# Altium schematic sheet Signal from Voltage detection.SchDoc
size A4
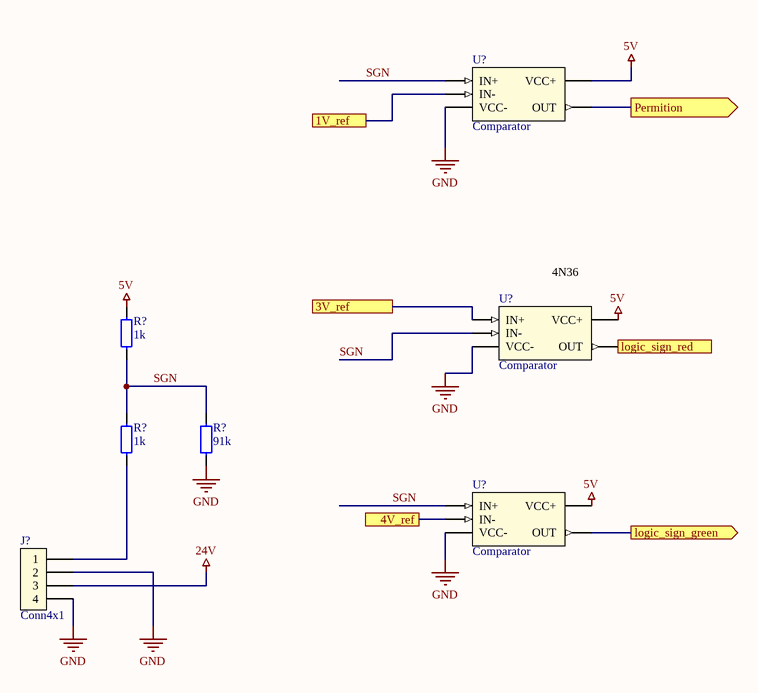
[diagram p0: Signal from Voltage detection.SchDoc]

## Parts
(Parts that share a designator on the sheet are numbered #1, #2 ... from top to bottom, then left to right.)
J?  Conn4x1  [MolexMicroFit 4x1]
R?#1  1k  [0603 Resistor]
R?#2  1k  [0603 Resistor]
R?#3  91k  [0603 Resistor]
U?#1  Comparator  [SOT-23-5]
U?#2  Comparator  [SOT-23-5]
U?#3  Comparator  [SOT-23-5]

## Ports
1V_ref, 3V_ref, 4V_ref, logic_sign_green (out), logic_sign_red (out), Permition (out)

## Nets
5V: R?#1.2 U?#1.5(VCC+) U?#2.5(VCC+) U?#3.5(VCC+)
24V: J?.3
GND: J?.2 J?.4 R?#3.1 U?#1.2(VCC-) U?#2.2(VCC-) U?#3.2(VCC-)
1V_ref: U?#1.4(IN-) ; port 1V_ref
3V_ref: U?#2.3(IN+) ; port 3V_ref
4V_ref: U?#3.4(IN-) ; port 4V_ref
logic_sign_green: U?#3.1(OUT) ; port logic_sign_green
logic_sign_red: U?#2.1(OUT) ; port logic_sign_red
Permition: U?#1.1(OUT) ; port Permition
SGN: R?#1.1 R?#2.2 R?#3.2 U?#1.3(IN+) U?#2.4(IN-) U?#3.3(IN+)
NetJ?_1: J?.1 R?#2.1

## Notes on the sheet
- (near U?#2) 4N36

## Library data of the parts
J? = Conn4x1 [MicroFit]: Micro-Fit 3.0 Right-Angle Header, 3.00mm Pitch, Single Row, 4 Circuits, with Snap-in Plastic Peg PCB Lock, Tin, Glow-Wire Capable, Black; Part Number: 436500400; Manufacturer: Molex; ComponentLink1Description: Molex; ComponentLink1URL: https://www.molex.com/molex/products/part-detail/pcb_headers/0436500400; Type: Connector
R?#1 R?#2 = Res 1k (0603): 0.1W 0603 1k, 1%; Part Number: RC0603FR-071KL; Manufacturer: Taiwan; Type: Resistor; ComponentLink1Description: Chip&Dip; ComponentLink1URL: https://www.chipdip.ru/product0/9000079676
R?#3 = Res 91k (0603): 0.1W 0603 91k, 1%; Part Number: RC0603FR-0791KL; Manufacturer: Taiwan; Type: Resistor; ComponentLink1Description: Chip&Dip; ComponentLink1URL: https://www.chipdip.ru/product0/9000079759
U?#1-U?#3 = Comparator [LMV]: LMV7219 7-ns 2.7-V to 5-V Comparator with Rail-to-Rail Output; Part Number: LMV7219M5X/NOPB; Manufacturer: Texas Instruments; ComponentLink1Description: DataSheet; ComponentLink1URL: http://www.ti.com/lit/ds/symlink/lmv7219.pdf; ComponentLink2Description: Mouser; ComponentLink2URL: https://ru.mouser.com/ProductDetail/Texas-Instruments/LMV7219M5X-NOPB?qs=sGAEpiMZZMuayl%2FEk2kXcbEcxwmoPguctVQUIBgrLJY%3D; Type: IC